# EAGLE design Patch-Prop1 (EAGLE 6.1)
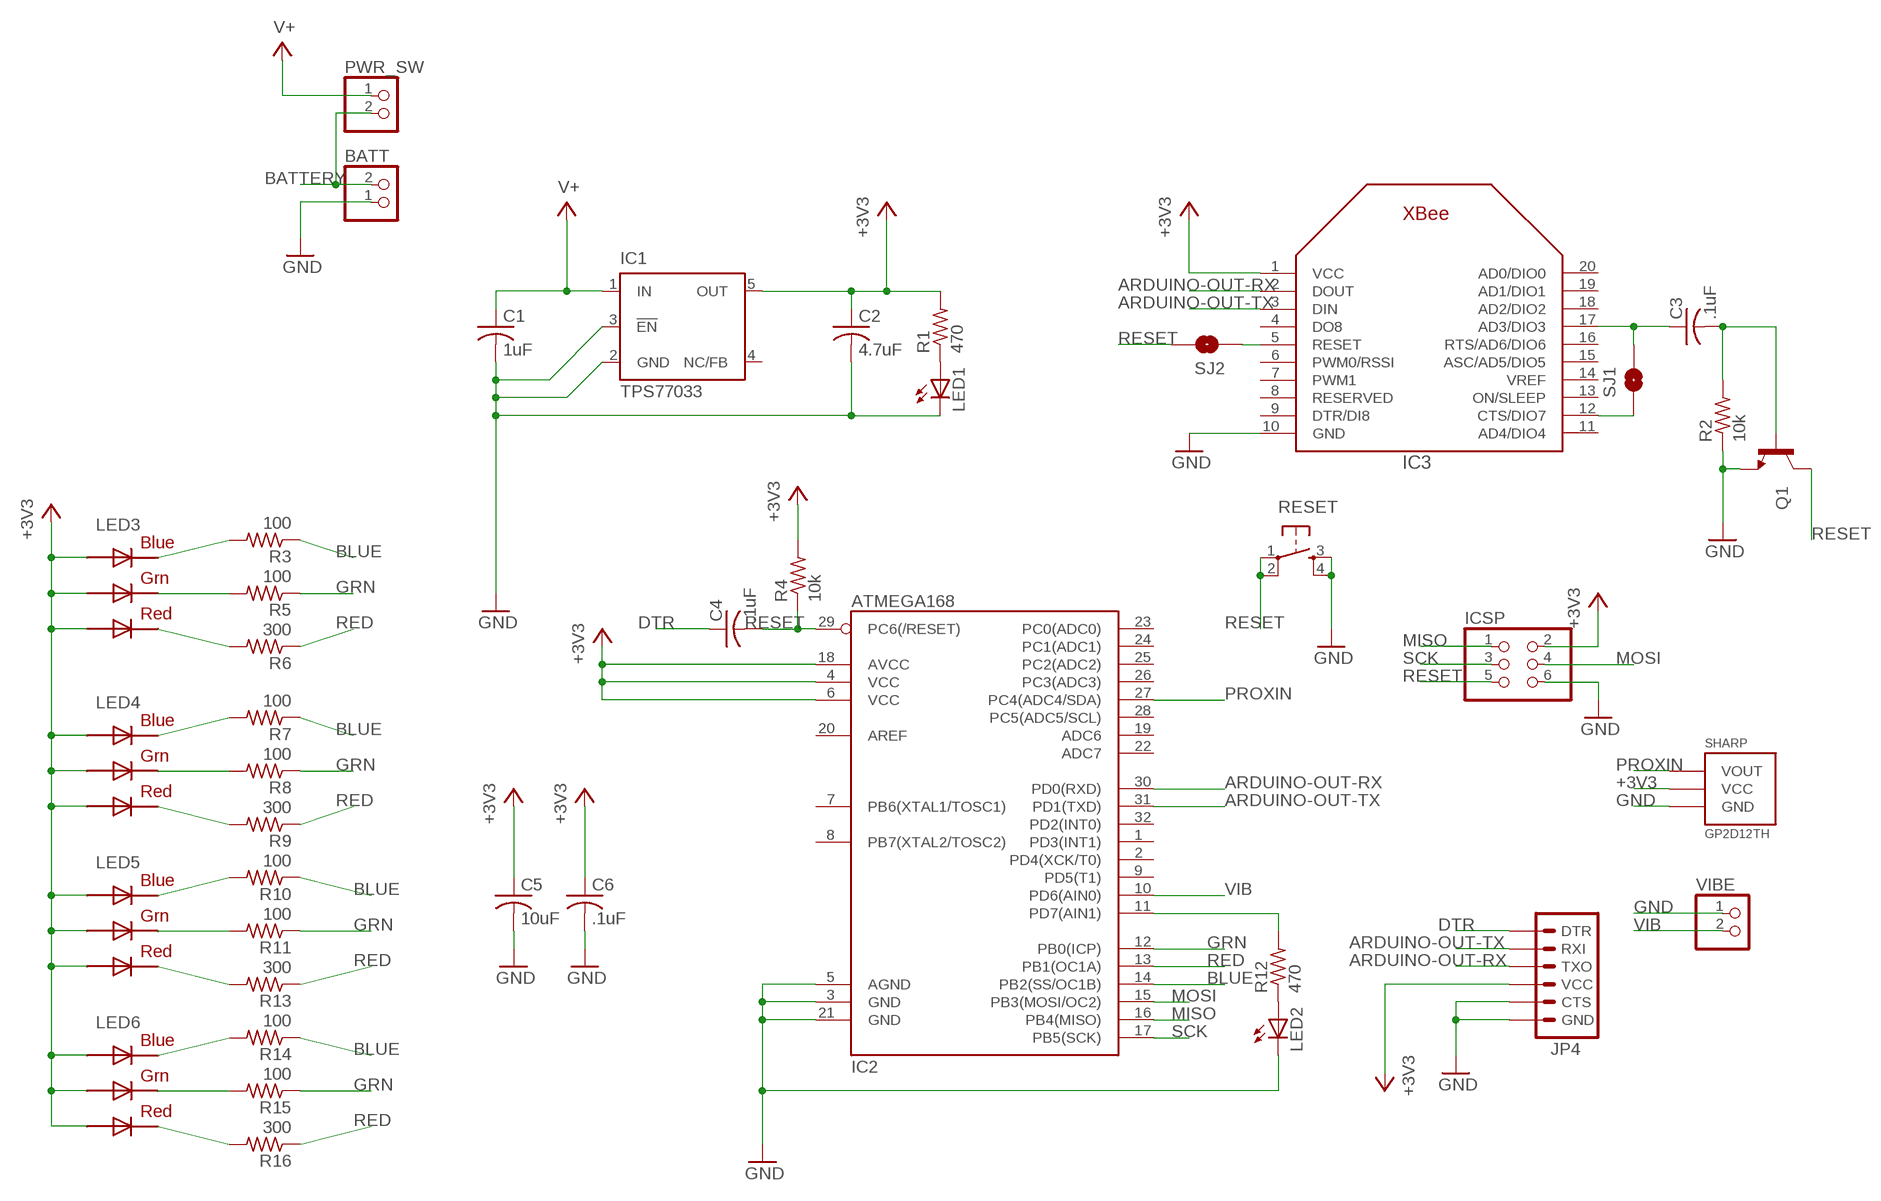
[diagram p0: schematic, sheet 1]

## Parts
BATT  JST_2PIN-SMT-RA  [JST-PH-2-SMT-RA]
C1  1uF  C-USC0603  [C0603]
C2  4.7uF  C-USC0603  [C0603]
C3  .1uF  C-USC0603  [C0603]
C4  .1uF  C-USC0603  [C0603]
C5  10uF  C-USC0603  [C0603]
C6  .1uF  C-USC0603  [C0603]
IC1  TPS77033  [SOT23-DBV]
IC2  ATMEGA168  [TQFP32-08]
IC3  XBEE  [XBEE]
ICSP  PINHD-2X3  [2X03]
JP4  ARDUINO_SERIAL_PROGRAMSMD  [1X06-SMD]
LED1  LEDCHIPLED_0805  [CHIPLED_0805]
LED2  LEDCHIPLED_0805  [CHIPLED_0805]
LED3  RGBLED5050  [RGBLED5050]
LED4  RGBLED5050  [RGBLED5050]
LED5  RGBLED5050  [RGBLED5050]
LED6  RGBLED5050  [RGBLED5050]
PWR_SW  PINHD-1X2  [1X02]
Q1  TRANSISTOR_NPNSOT89  [SOT89]
R1  470  R-US_R0603  [R0603]
R2  10k  R-US_R0603  [R0603]
R3  100  R-US_R0603  [R0603]
R4  10k  R-US_R0603  [R0603]
R5  100  R-US_R0603  [R0603]
R6  300  R-US_R0603  [R0603]
R7  100  R-US_R0603  [R0603]
R8  100  R-US_R0603  [R0603]
R9  300  R-US_R0603  [R0603]
R10  100  R-US_R0603  [R0603]
R11  100  R-US_R0603  [R0603]
R12  470  R-US_R0603  [R0603]
R13  300  R-US_R0603  [R0603]
R14  100  R-US_R0603  [R0603]
R15  100  R-US_R0603  [R0603]
R16  300  R-US_R0603  [R0603]
RESET  TAC_SWITCHPTH  [TACTILE-PTH]
SHARP  GP2D12TH  [GP2D12]
SJ1  SOLDERJUMPERNO  [SJ_2S-NO]
SJ2  SOLDERJUMPERNO  [SJ_2S-NO]
VIBE  PINHD-1X2  [1X02]

## Nets
+3V3: C2.1 C5.1 C6.1 IC1.5(OUT) IC2.4(VCC) IC2.6(VCC) IC2.18(AVCC) IC3.1(VCC) ICSP.2 JP4.4(VCC) LED3.1(GREEN_A) LED3.2(RED_A) LED3.3(BLUE_A) LED4.1(GREEN_A) LED4.2(RED_A) LED4.3(BLUE_A) LED5.1(GREEN_A) LED5.2(RED_A) LED5.3(BLUE_A) LED6.1(GREEN_A) LED6.2(RED_A) LED6.3(BLUE_A) R1.2 R4.2 SHARP.VCC
ARDUINO-OUT-RX: IC2.30(PD0(RXD)) IC3.2(DOUT) JP4.3(TXO)
ARDUINO-OUT-TX: IC2.31(PD1(TXD)) IC3.3(DIN) JP4.2(RXI)
BATTERY: BATT.2 PWR_SW.2
BLUE: IC2.14(PB2(SS/OC1B)) R3.1 R7.1 R10.1 R14.1
DTR: C4.1 JP4.1(DTR)
GND: BATT.1 C1.2 C2.2 C5.2 C6.2 IC1.2(GND) IC1.3(!EN) IC2.3(GND) IC2.5(AGND) IC2.21(GND) IC3.10(GND) ICSP.6 JP4.5(CTS) JP4.6(GND) LED1.C LED2.C Q1.3(E) R2.1 RESET.3 RESET.4 SHARP.GND VIBE.1
GRN: IC2.12(PB0(ICP)) R5.1 R8.1 R11.1 R15.1
MISO: IC2.16(PB4(MISO)) ICSP.1
MOSI: IC2.15(PB3(MOSI/OC2)) ICSP.4
N$1: C3.1 IC3.17(AD3/DIO3) SJ1.2
N$2: C3.2 Q1.1(B) R2.2
N$3: LED1.A R1.1
N$4: LED2.A R12.1
N$5: IC2.11(PD7(AIN1)) R12.2
N$6: LED4.4(BLUE_C) R7.2
N$7: LED3.5(RED_C) R6.2
N$8: LED3.4(BLUE_C) R3.2
N$9: LED3.6(GREEN_C) R5.2
N$10: LED4.6(GREEN_C) R8.2
N$11: LED5.4(BLUE_C) R10.2
N$12: LED4.5(RED_C) R9.2
N$13: LED5.5(RED_C) R13.2
N$14: LED5.6(GREEN_C) R11.2
N$15: LED6.4(BLUE_C) R14.2
N$16: LED6.6(GREEN_C) R15.2
N$17: LED6.5(RED_C) R16.2
N$18: IC3.12(CTS/DIO7) SJ1.1
N$19: IC3.5(RESET) SJ2.1
PROXIN: IC2.27(PC4(ADC4/SDA)) SHARP.VOUT
RED: IC2.13(PB1(OC1A)) R6.1 R9.1 R13.1 R16.1
RESET: C4.2 IC2.29(PC6(/RESET)) ICSP.5 Q1.2(C) R4.1 RESET.1 RESET.2 SJ2.2
SCK: IC2.17(PB5(SCK)) ICSP.3
V+: C1.1 IC1.1(IN) PWR_SW.1
VIB: IC2.10(PD6(AIN0)) VIBE.2
Unconnected: IC1.4(NC/FB) IC2.1(PD3(INT1)) IC2.2(PD4(XCK/T0)) IC2.7(PB6(XTAL1/TOSC1)) IC2.8(PB7(XTAL2/TOSC2)) IC2.9(PD5(T1)) IC2.19(ADC6) IC2.20(AREF) IC2.22(ADC7) IC2.23(PC0(ADC0)) IC2.24(PC1(ADC1)) IC2.25(PC2(ADC2)) IC2.26(PC3(ADC3)) IC2.28(PC5(ADC5/SCL)) IC2.32(PD2(INT0)) IC3.4(DO8) IC3.6(PWM0/RSSI) IC3.7(PWM1) IC3.8(RESERVED) IC3.9(DTR/DI8) IC3.11(AD4/DIO4) IC3.13(ON/SLEEP) IC3.14(VREF) IC3.15(ASC/AD5/DIO5) IC3.16(RTS/AD6/DIO6) IC3.18(AD2/DIO2) IC3.19(AD1/DIO1) IC3.20(AD0/DIO0)

## Library data of the parts
BATT = adafruit:JST_2PIN: JST 2-Pin Connectors of various flavors SMT-RA (S2B-PH-SM4) 4UConnector #17311 SMT (B2B-PH-SM4) THM-RA (S2B-PH) THM (B2B-PH)
C1-C6 = rcl:C-US: CAPACITOR, American symbol
IC1 = texas:TPS770*: ULTRALOW-POWER 50-mA LOW-DROPOUT LINEAR REGULATORS 50-mA Low-Dropout Regulator Source: http://focus.ti.com/lit/ds/symlink/tps77001.pdf; MF: TEXAS INSTRUMENTS; MPN: TPS77033DBVT; OC_FARNELL: 8461570; OC_NEWARK: 77C1187
IC2 = SparkFun:ATMEGA168
IC3 = adafruit:XBEE
ICSP = pinhead:PINHD-2X3: PIN HEADER
JP4 = SparkFun:ARDUINO_SERIAL_PROGRAM
LED1 LED2 = led:LED: LED OSRAM: - CHIPLED LG R971, LG N971, LY N971, LG Q971, LY Q971, LO R971, LY R971 LH N974, LH R974 LS Q976, LO Q976, LY Q976 LO Q996 - Hyper CHIPLED LW Q18S LB Q993, LB Q99A, LB R99A - SideLED LS A670, LO A670, LY A670, LG A670, LP A670 LB A673, LV A673, LT A673, LW A673 LH A674 LY A675 LS A676, LA A676, LO A676, LY A676, LW A676 LS A679, LY A679, LG A679 - Hyper Micro SIDELED® LS Y876, LA Y876, LO Y876, LY Y876 LT Y87S - SmartLED LW L88C, LW L88S LB L89C, LB L89S, LG L890 LS L89K, LO L89K, LY L89K LS L896, LA L896, LO L896, LY L896 - TOPLED LS T670, LO T670, LY T670, LG T670, LP T670 LSG T670, LSP T670, LSY T670, LOP T670, LYG T670 LG T671, LOG T671, LSG T671 LB T673, LV T673, LT T673, LW T673 LH T674 LS T676, LA T676, LO T676, LY T676, LB T676, LH T676, LSB T676, LW T676 LB T67C, LV T67C, LT T67C, LS T67K, LO T67K, LY T67K, LW E67C LS E67B, LA E67B, LO E67B, LY E67B, LB E67C, LV E67C, LT E67C LW T67C LS T679, LY T679, LG T679 LS T770, LO T770, LY T770, LG T770, LP T770 LB T773, LV T773, LT T773, LW T773 LH T774 LS E675, LA E675, LY E675, LS T675 LS T776, LA T776, LO T776, LY T776, LB T776 LHGB T686 LT T68C, LB T68C - Hyper Mini TOPLED® LB M676 - Mini TOPLED Santana® LG M470 LS M47K, LO M47K, LY M47K Source: http://www.osram.convergy.de LUXEON: - LUMILED® LXK2-PW12-R00, LXK2-PW12-S00, LXK2-PW14-U00, LXK2-PW14-V00 LXK2-PM12-R00, LXK2-PM12-S00, LXK2-PM14-U00 LXK2-PE12-Q00, LXK2-PE12-R00, LXK2-PE12-S00, LXK2-PE14-T00, LXK2-PE14-U00 LXK2-PB12-K00, LXK2-PB12-L00, LXK2-PB12-M00, LXK2-PB14-N00, LXK2-PB14-P00, LXK2-PB14-Q00 LXK2-PR12-L00, LXK2-PR12-M00, LXK2-PR14-Q00, LXK2-PR14-R00 LXK2-PD12-Q00, LXK2-PD12-R00, LXK2-PD12-S00 LXK2-PH12-R00, LXK2-PH12-S00 LXK2-PL12-P00, LXK2-PL12-Q00, LXK2-PL12-R00 Source: www.luxeon.com KINGBRIGHT: KA-3528ASYC Source: www.kingbright.com
LED3-LED6 = adafruit:RGBLED: For 5050 RGB LEDs, the order of the LEDs may vary from one manufacturer to another!
PWR_SW VIBE = pinhead:PINHD-1X2: PIN HEADER
Q1 = SparkFun:TRANSISTOR_NPN: Transistor NPN BJT configuration in SOT23 package. MMBT2222 is the common NPN we use. Double check BCE configuration again layout.
R1-R16 = rcl:R-US_: RESISTOR, American symbol
RESET = SparkFun:TAC_SWITCH: Momentary Switch Button commonly used for reset or general input. Spark Fun Electronics SKU : COM-00097
SHARP = Sparky:GP2D12
SJ1 SJ2 = SparkFun:SOLDERJUMPER: Solder Jumper Standard SMD solder jumper. Used to automate production. Two varients : Normally Open and Normally Closed are the same, but have different paste layers. NC will have a large amount of paste and should jumper during reflow.

## Board
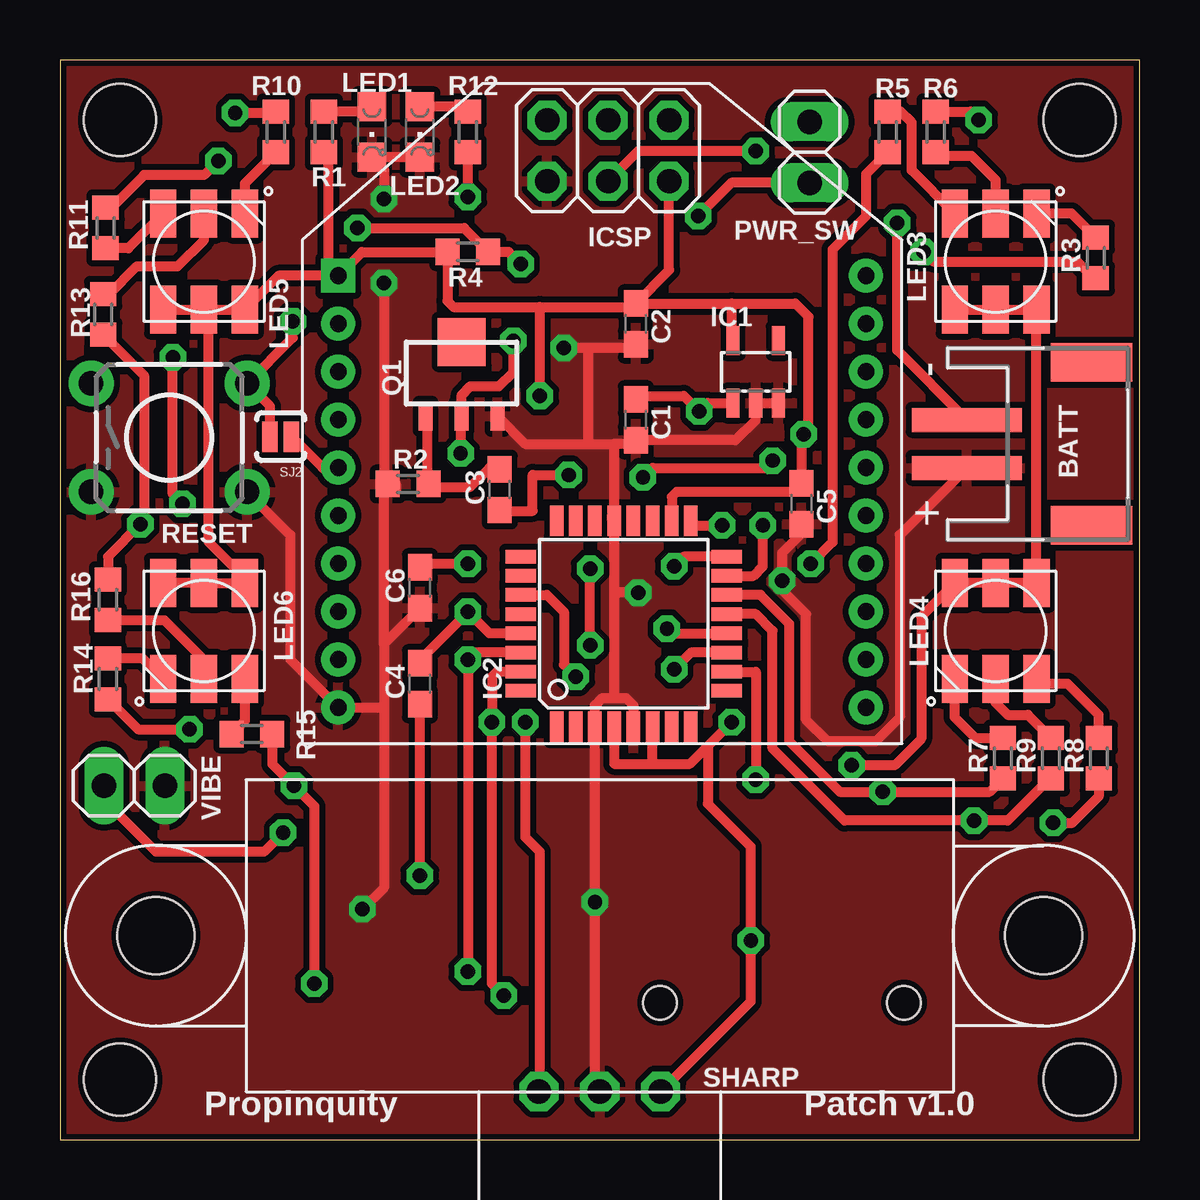
[diagram p1: board, top side]
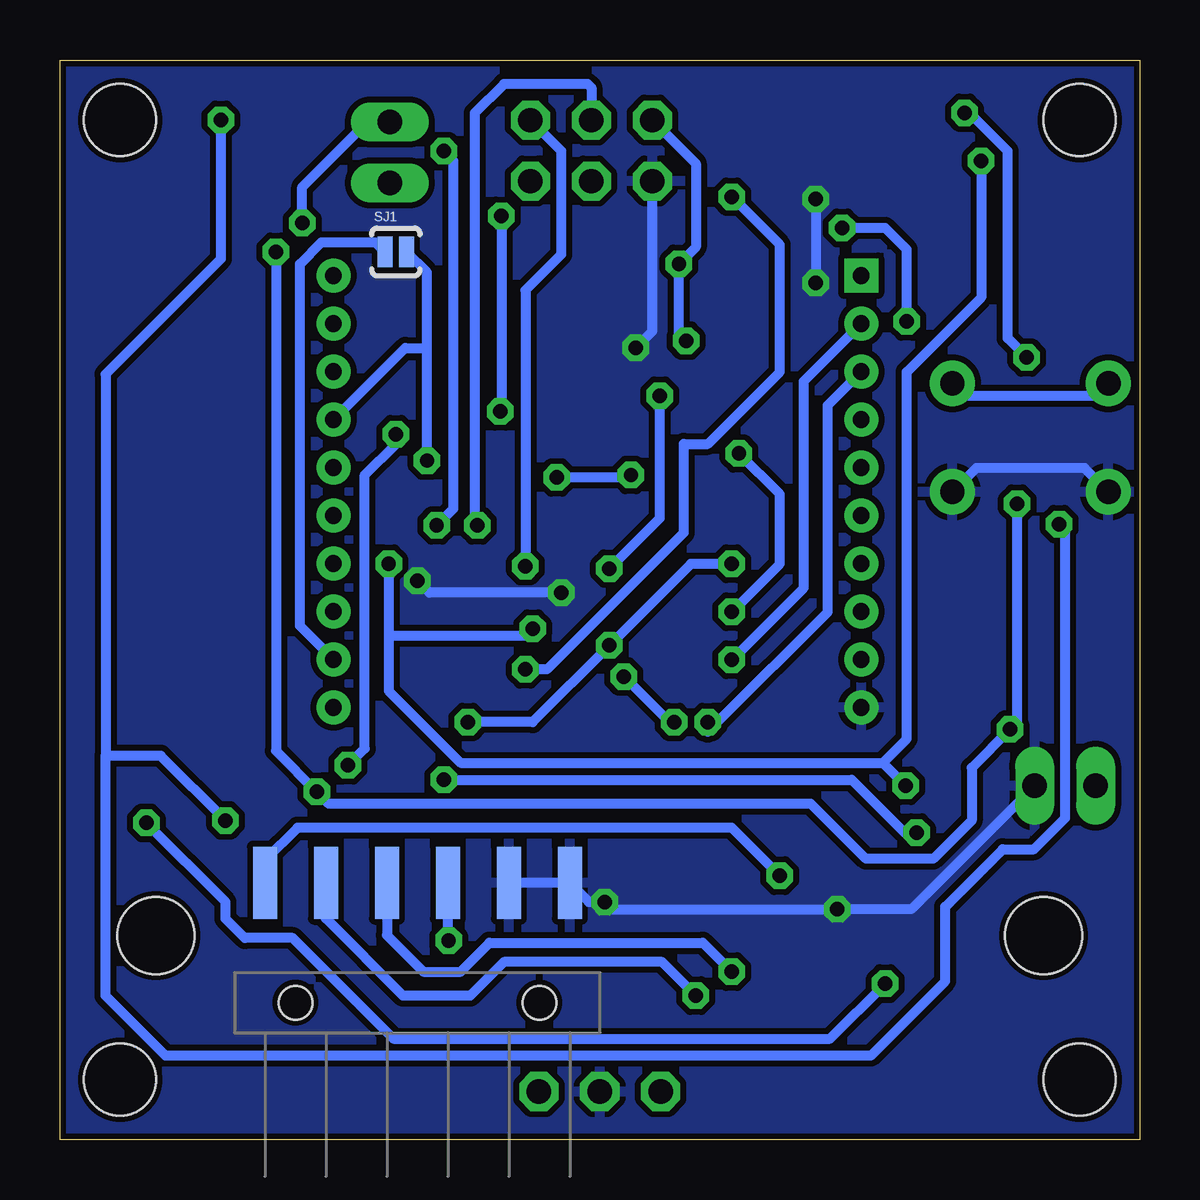
[diagram p2: board, bottom side, seen from below]

Size 45 x 45 mm. Coordinates in mm from the lower left corner, seen from the top.
Outline: 0,0 45,0 45,45 0,45 0,0
Copper layers (1*16): Top 0.035mm / dielectric 1.5mm / Bottom 0.035mm
Design rules: minimum track width 7mil, minimum drill 15mil, track to track 8mil, track to pad 8mil, pad to pad 8mil, via to via 8mil, smd to smd 1mil, copper to edge 8mil, drill to drill 8mil, minimum pad ring 12mil, minimum via ring 10mil, stop-mask expansion 4mil, vias tented up to drill 25mil, thermal gap 10mil
Holes 3 mm at 2.5,2.5 42.5,2.5 42.5,42.5 2.5,42.5

### Footprints (pad centres in the part's own frame; a part is rotated, then mirrored left to right if it is on the bottom)
JST-PH-2-SMT-RA = smd 1 x 4.6: 1 1,-3.7; 2 -1,-3.7 | smd 1.6 x 3.4: NC1 -3.4,1.5; NC2 3.4,1.5
C0603 = smd 1.1 x 1: 1 -0.85,0; 2 0.85,0
SOT23-DBV = smd 0.55 x 1.2: 1 -0.95,-1.3; 2 0,-1.3; 3 0.95,-1.3; 4 0.95,1.3; 5 -0.95,1.3
TQFP32-08 = smd 1.27 x 0.559: 1 -4.293,2.8; 2 -4.293,2; 3 -4.293,1.2; 4 -4.293,0.4; 5 -4.293,-0.4; 6 -4.293,-1.2; 7 -4.293,-2; 8 -4.293,-2.8; 17 4.293,-2.8; 18 4.293,-2; 19 4.293,-1.2; 20 4.293,-0.4; 21 4.293,0.4; 22 4.293,1.2; 23 4.293,2; 24 4.293,2.8 | smd 0.559 x 1.27: 9 -2.8,-4.293; 10 -2,-4.293; 11 -1.2,-4.293; 12 -0.4,-4.293; 13 0.4,-4.293; 14 1.2,-4.293; 15 2,-4.293; 16 2.8,-4.293; 25 2.8,4.293; 26 2,4.293; 27 1.2,4.293; 28 0.4,4.293; 29 -0.4,4.293; 30 -1.2,4.293; 31 -2,4.293; 32 -2.8,4.293
XBEE = drill 0.7 pad 1.422 square: 1 -11,5.5 | drill 0.7 pad 1.422: 2 -11,3.5; 3 -11,1.5; 4 -11,-0.5; 5 -11,-2.5; 6 -11,-4.5; 7 -11,-6.5; 8 -11,-8.5; 9 -11,-10.5; 10 -11,-12.5; 11 11,-12.5; 12 11,-10.5; 13 11,-8.5; 14 11,-6.5; 15 11,-4.5; 16 11,-2.5; 17 11,-0.5; 18 11,1.5; 19 11,3.5; 20 11,5.5
2X03 = drill 1.016 octagon: 1 -2.54,-1.27; 2 -2.54,1.27; 3 0,-1.27; 4 0,1.27; 5 2.54,-1.27; 6 2.54,1.27
1X06-SMD = smd 1 x 3: 1 -6.35,5; 2 -3.81,5; 3 -1.27,5; 4 1.27,5; 5 3.81,5; 6 6.35,5 | hole 1.4: -5.08,0; 5.08,0
CHIPLED_0805 = smd 1.2 x 1.2: A 0,-1.05; C 0,1.05
RGBLED5050 = smd 2 x 1.1: 1 -2,1.7; 2 -2,0; 3 -2,-1.7; 4 2,-1.7; 5 2,0; 6 2,1.7
1X02 = drill 1.016 long: 1 -1.27,0; 2 1.27,0
SOT89 = smd 0.58 x 1.2: 1 -1.5,-1.8; 2 0,-1.8; 3 1.5,-1.8 | smd 2 x 2: 4 0,1.3
R0603 = smd 1 x 1.1: 1 -0.85,0; 2 0.85,0
TACTILE-PTH = drill 1.016 pad 1.88: 1 -3.251,2.261; 2 3.251,2.261; 3 -3.251,-2.261; 4 3.251,-2.261
GP2D12 = drill 1.016 octagon: GND 0,0; VCC 2.54,0; VOUT -2.54,0 | hole 3.2: 18.5,6.5; -18.5,6.5
SJ_2S-NO = smd 0.635 x 1.27: 1 -0.45,0; 2 0.45,0

### Placement (x,y rotation side)
BATT  41.5,29 270 top
C1  24,30 270 top
C2  24,34 270 top
C3  18.33,27.09 90 top
C4  15,19 90 top
C5  30.9,26.5 270 top
C6  15,23 270 top
IC1  29,32 0 top
IC2  23.5,21.5 90 top
IC3  22.6,30.51 0 top
ICSP  22.85,41.22 180 top
JP4  30.1,5.7 0 bottom
LED1  13,42 180 top
LED2  15,42 180 top
LED3  39,36.6 90 top
LED4  39,21.2 270 top
LED5  6,36.6 90 top
LED6  6,21.2 270 top
PWR_SW  31.25,41.15 90 top
Q1  16.74,31.95 0 top
R1  11,42 270 top
R2  14.51,27.33 0 top
R3  43.17,36.75 90 top
R4  17,37 180 top
R5  34.5,42 90 top
R6  36.5,42 270 top
R7  39.3,15.9 90 top
R8  43.3,15.9 90 top
R9  41.3,15.9 90 top
R10  9,42 270 top
R11  1.9,38 270 top
R12  17,42 270 top
R13  1.8,34.4 90 top
R14  2,19.2 90 top
R15  8,16.9 180 top
R16  2,22.5 270 top
RESET  4.55,29.26 0 top
SHARP  22.5,2 0 top
SJ1  31,37 0 bottom
SJ2  9.2,29.3 180 top
VIBE  3.1,14.75 180 top

### Tracks (layer width: path | path; a pad name or v marks a point on that pad's centre or on a via)
+3V3  (via drill 0.6)
  Top 0.406: 20,34.7 16.4,34.7 16.15,34.95 R4.2 12.59,37 IC3.1 | 20,34.7 23.85,34.7 C2.1 | C2.1 28,34.85 | 28,34.85 30.65,34.85 31.2,34.3 31.2,29.6 v31,29.4 30.9,29.3 C5.1 30.9,27.1 31,27 25.7,27 25.5,26.8 IC2.18 | IC2.4 23.1,15.66 24.7,15.66 | v17,24 15,24 C6.1 | v22.1,20.6 v22.1,23.8 | v20,31 20,34.7 | C2.1 25.39,36.24 ICSP.2 | 10.9,41.15 R1.2 11.2,41.15 11.2,36.41 IC3.1 | IC1.5 28,33.35 28,34.85 | 24.7,15.66 IC2.6 | v28,17.4 27,16.4 | 27,16.4 27,14 28.8,12.2 v28.8,8.3 28.8,5.76 SHARP.VCC | 24.7,15.66 26.26,15.66 27,16.4 | LED5.1 LED5.2 | LED5.2 LED5.3 9.11,36.01 IC3.1 | LED3.1 38.6,34.6 | 38.6,34.6 39,35 | 38.6,34.6 LED3.2 LED3.3 LED4.1 LED4.2 LED4.3 35.9,21.8 35.9,16.7 34.8,15.6 v33,15.6 | LED6.3 LED6.2 LED6.1 7.8,23.3 6.2,24.9 6.2,34.4 LED5.2
  Bottom 0.406: v20,31 20,25.9 v22.1,23.8 | v28,17.4 25.3,17.4 v22.1,20.6 18.7,24 v17,24 | v28.8,8.3 28.83,8.33 JP4.4 | v33,15.6 32.3,16.3 32.3,27.7 31,29 v31,29.4
ARDUINO-OUT-RX  (via drill 0.6)
  Top 0.406: IC2.30 17.3,20.3 v17,20 v17,7
  Bottom 0.406: v17,20 14,23 14,31.61 IC3.2 | JP4.3 31.37,8.52 29.85,7 28.3,7 27.1,8.2 18.2,8.2 v17,7
ARDUINO-OUT-TX  (via drill 0.6)
  Top 0.406: IC2.31 18.2,19.5 18,19.3 v18,17.4 18,6.5 v18.5,6
  Bottom 0.406: v18,17.4 17.6,17.4 13,22 13,30.61 IC3.3 | 18.1,17.4 v18,17.4 | v18,17.4 18,17 | JP4.2 33.91,9.21 30.7,6 27.9,6 26.5,7.4 19.9,7.4 v18.5,6
BATTERY  (via drill 0.6)
  Top 0.406: BATT.2 34.9,32.9 v34.9,38.2
  Bottom 0.406: PWR_SW.2 32.18,42.42 34.9,39.7 v34.9,38.2
BLUE  (via drill 0.6)
  Top 0.406: 27.7,22.7 IC2.14 29.2,22.7 30.4,21.5 30.4,16.6 32.5,14.5 v34.3,14.5 38.75,14.5 R7.1 38.95,15.4 | v36,37 36.4,36.6 42.4,36.6 43.1,35.9 R3.1 | R14.1 3.25,17.1 v5.4,17.1 | v5.1,26.5 4.7,26.9 v4.7,32.6 | v7.3,42.8 8.95,42.8 R10.1
  Bottom 0.406: v5.1,26.5 5.1,17.4 v5.4,17.1 7,15.5 7,13.3 8.6,11.7 11.4,11.7 13.7,14 33.8,14 v34.3,14.5 36,16.2 v36,37 | v4.7,32.6 5.5,33.4 5.5,41.2 7.1,42.8 v7.3,42.8
DTR  (via drill 0.6)
  Top 0.406: v15,11 C4.1
  Bottom 0.406: v15,11 17,13 35.1,13 36.45,11.65 JP4.1
GND  (via drill 0.6)
  Top 0.406: 23.1,29 24,29 C1.2 28.15,29.15 29,30 IC1.2 IC1.3 | 23.1,29 IC2.21 | Q1.3 19.39,29 22,29 | 22,29 23.1,29 | 14.7,22.3 15,22 C6.2 13.5,20.65 | C2.2 23.85,33 22,33 | 22,33 v21,33 | 13.5,20.65 13.5,27 | 23,18.4 22.6,18.4 22.3,18.1 IC2.3 v22.3,9.9 22.3,2.2 SHARP.GND | 23,18.4 23.6,18.4 23.9,18.1 IC2.5 | 13.5,27.3 14,27.3 | 14,27.3 14,27 13.5,27 | v13.5,35.7 13.5,27.17 | 13.5,27.17 13.5,27 | 14,27.3 14,27.33 R2.1 13.66,27.17 13.5,27.17 | IC2.21 arc-90 23,25.89 23,26 | LED2.C LED1.C 13.5,40.45 v13.5,39.2 | 22,33 22,29 | IC2.21 23.1,23 | 23.1,23 23.1,18.5 23,18.4 | C5.2 31.1,25.45 30.1,24.45 v30.1,23.3 30.1,22.9 31.1,21.9 31.1,17.5 32,16.6 34,16.6 35,17.6 35,25.2 BATT.1 | v24.1,22.8 23.3,22.8 23.1,23 | 13.5,20.65 13.5,18 | 13.5,18 13.5,10.5 v12.6,9.6 | RESET.4 9.6,25.2 9.6,20.01 IC3.10 13.49,18.01 13.5,18
  Bottom 0.406: v21,33 20.31,33.69 ICSP.6 | v13.5,39.2 v13.5,35.7 | v24.1,22.8 29.6,22.8 v30.1,23.3 | RESET.3 2.3,28 6.8,28 RESET.4 | VIBE.1 9.52,9.6 v12.6,9.6 22,9.6 v22.3,9.9 22.95,9.9 JP4.6 JP4.5
  pour Top (isolate 0.25): 0,45 45,45 45,0 0,0
  pour Bottom (isolate 0.25): 0,45 45,45 45,0 0,0
GRN  (via drill 0.6)
  Top 0.406: R11.1 2.15,38.85 3.5,40.2 6,40.2 v6.6,40.8 | R5.1 33.6,40.25 33.6,38.5 32.2,37.1 32.2,24.9 v31.3,24 | v25.3,21.3 25.5,21.1 IC2.12 | R15.1 8.85,15.65 v9.75,14.75 10.6,13.9 v10.6,6.5 | v41.4,13.2 42.2,13.2 43.3,14.3 R8.1
  Bottom 0.406: v6.6,40.8 6.6,35.1 9.7,32 9.7,16.7 10.7,15.7 | v10.6,6.5 12.9,4.2 31.1,4.2 35.3,8.4 37.3,8.4 38.1,9.2 38.1,9.9 v41.4,13.2 | 10.4,15.4 v9.75,14.75 10.7,15.7 | 10.7,15.7 28.3,15.7 31.3,18.7 31.3,21 | v31.3,24 31.3,21 | v25.3,21.3 25.6,21 31.3,21
MISO  (via drill 0.6)
  Top 0.406: IC2.16 26,24.3 v25.6,23.9 25.5,23.8
  Bottom 0.406: ICSP.1 24.1,41.2 24.1,36.9 25.6,35.4 v25.6,23.9
MOSI  (via drill 0.6)
  Top 0.406: 28,23.5 IC2.15 28.9,23.5 29.3,23.9 v29.3,25.6 | ICSP.4 23.95,41.05 24.1,41.2 v29,41.2
  Bottom 0.406: v29.3,25.6 28.6,26.3 28.6,40.8 v29,41.2
N$1  (via drill 0.6)
  Top 0.406: C3.1 18.33,26.2 19.7,26.2 19.7,27.7 v21.2,27.7 | v24.3,27.6 24.7,28 29.4,28 v29.7,28.3
  Bottom 0.406: v21.2,27.7 21.2,27.6 v24.3,27.6 | v29.7,28.3 29.7,33 | 29.7,33 29.7,36.15 SJ1.2 | IC3.17 30.61,33 29.7,33
N$2
  Top 0.406: Q1.1 15.3,30.15 15.3,27.2 15.36,27.2 | 15.36,27.2 17.1,27.2 17.9,28 18,28 18,27.94 C3.2 | 15.36,27.2 R2.2
N$3
  Top 0.406: LED1.A 12.8,42.85 R1.1
N$4
  Top 0.406: R12.1 16.8,43.05 LED2.A
N$5  (via drill 0.6)
  Top 0.406: IC2.11 26.3,20.3 v25.6,19.6 | v17,39.3 R12.2
  Bottom 0.406: v17,39.3 15,37.3 15,32 18,29 19,29 19,25.3 24.7,19.6 v25.6,19.6
N$6
  Top 0.406: LED4.4 37.3,17.6 38.15,16.75 R7.2
N$7
  Top 0.406: LED3.5 39,40 38,41 36.65,41 R6.2
N$8
  Top 0.406: R3.2 42.17,38.6 LED3.4
N$9
  Top 0.406: LED3.6 35.5,40.4 35.5,42.4 35.05,42.85 R5.2
N$10
  Top 0.406: R8.2 43.3,17.7 42,19 40.9,19 LED4.6
N$11
  Top 0.406: R10.2 7.7,39.85 LED5.4
N$12
  Top 0.406: LED4.5 39,18.2 39.5,17.7 40.35,17.7 R9.2
N$13
  Top 0.406: R13.2 2.05,35.25 3.2,36.4 4.9,36.4 6,37.5 LED5.5
N$14
  Top 0.406: LED5.6 2.85,37.15 R11.2
N$15
  Top 0.406: LED6.4 3.45,20.05 R14.2
N$16
  Top 0.406: LED6.6 7.7,17.45 R15.2
N$17
  Top 0.406: R16.2 4.35,21.65 6,20 LED6.5
N$18
  Bottom 0.406: IC3.12 35,21.41 35,36.5 34.1,37.4 31.85,37.4 SJ1.1
N$19
  Top 0.406: SJ2.1 10.94,28.01 IC3.5
PROXIN  (via drill 0.6)
  Top 0.406: IC2.27 20.3,22.7 21,22 21,19.8 v21.5,19.3 | v19.4,17.4 19.4,12.6 20,12 20,2.04 SHARP.VOUT
  Bottom 0.406: v19.4,17.4 19.6,17.4 v21.5,19.3
RED  (via drill 0.6)
  Top 0.406: IC2.13 29,21.9 29.7,21.2 29.7,16.3 32.7,13.3 v38.1,13.3 39.5,13.3 41.25,15.05 R9.1 | R6.1 37.95,42.85 v38.3,42.5 | R13.1 3.5,31.85 3.5,25.8 v3.35,25.65 2,24.3 R16.1
  Bottom 0.406: 43.1,16 43.1,6 40.6,3.5 11.2,3.5 8.1,6.6 8.1,9.7 5.7,12.1 4.4,12.1 3.1,13.4 3.1,25.4 v3.35,25.65 | v38.1,13.3 40.8,16 43.1,16 | 43.1,16 43.1,31.9 38.3,36.7 v38.3,42.5
RESET  (via drill 0.6)
  Top 0.406: v16.7,28.6 16.7,30.11 Q1.2 16.74,31.04 17.1,31.4 18.3,31.4 18.9,32 v18.9,33.3 | R4.1 18,36.85 | v19.2,36.5 18.7,37 R4.1 | IC2.29 17.9,21.1 v17,22 15,20 C4.2 | v12.4,38 16.85,38 R4.1 | SJ2.2 8.75,30.57 RESET.2 9.7,33.42 v9.7,34.1
  Bottom 0.406: v17,22 15,24 15,26.9 v16.7,28.6 | ICSP.5 18.5,40.68 18.5,37.2 v19.2,36.5 19.2,33.6 v18.9,33.3 | RESET.1 1.82,31 7.28,31 RESET.2 | v9.7,34.1 9.7,37.1 10.6,38 v12.4,38
SCK  (via drill 0.6)
  Top 0.406: IC2.17 26.49,25.6 v27.6,25.6
  Bottom 0.406: ICSP.3 22.85,43.85 23,44 26.5,44 27.7,42.8 27.7,25.7 v27.6,25.6
V+  (via drill 0.6)
  Top 0.406: C1.1 24.15,31 26,31 v26.65,30.35 27,30.7 IC1.1 | PWR_SW.1 27.98,39.88 v26.6,38.5
  Bottom 0.406: v26.6,38.5 26.6,30.4 v26.65,30.35
VIB  (via drill 0.6)
  Top 0.406: IC2.10 29,19.5 v29,15 | VIBE.2 1.83,14.17 4,12 8.5,12 v9.3,12.8
  Bottom 0.406: v29,15 12,15 9.8,12.8 v9.3,12.8

### Text on the board
_tsilk: Propinquity | Patch v1.0